# Altium project Projet_Carte_Bras_TurtleBot.PrjPcb
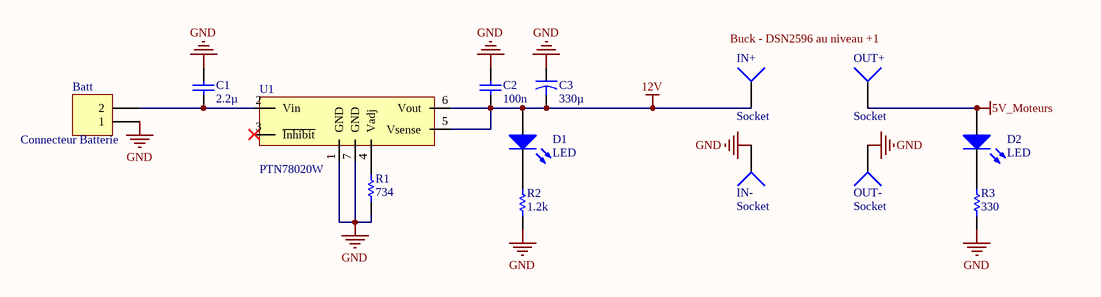
[diagram p0: Alimentations.SchDoc]
4 sheets, 89 parts. Net scope: flat (ports and power ports of the same name join across sheets).
Board file: PCB1.PcbDoc
Sheets:
  Alimentations.SchDoc
  Microcontroleur.SchDoc
  Connecteurs.SchDoc
  Controle Moteurs.SchDoc

## Sheet Alimentations.SchDoc
size A4

### Parts
Batt  Connecteur Batterie  [SHDR2W95P0X381_1X2_901X700X940P]
C1  value 2.2µ  [0805]  (hidden comment: Cap)
C2  value 100n  [0805]  (hidden comment: Cap)
C3  value 330µ  [CAPR5-4X5]  (hidden comment: Cap2)
D1  LED  [C0805]
D2  LED  [C0805]
IN+  Socket  [PIN1]
IN-  Socket  [PIN1]
OUT+  Socket  [PIN1]
OUT-  Socket  [PIN1]
R1  value 734  [0805]  (hidden comment: Res*)
R2  value 1.2k  [0805]  (hidden comment: Res*)
R3  value 330  [0805]  (hidden comment: Res*)
U1  PTN78020W  [PTN78020WAH]

### Nets
5V_Moteurs: D2.1(A) OUT+.1
12V: C2.1 C3.2 D1.1(A) IN+.1 U1.5(Vsense) U1.6(Vout)
GND: Batt.1 C1.2 C2.2 C3.1 IN-.1 OUT-.1 R1.1 R2.1 R3.2 U1.1(GND) U1.7(GND)
NetBatt_2: Batt.2 C1.1 U1.2(Vin)
NetD1_2: D1.2(K) R2.2
NetD2_2: D2.2(K) R3.1
NetR1_2: R1.2 U1.4(Vadj)

Not connected (* = marked no-connect by the designer): U1 3(~{Inhibit})*

### Notes on the sheet
- Labels drawn without touching a wire or pin: Buck - DSN2596 au niveau +1

### Library data of the parts
Batt = Header 2: Header, 2-Pin; LatestRevisionDate: 17-Jul-2002; LatestRevisionNote: Re-released for DXP Platform.; Publisher: Altium Limited
C1 = Cap: 2.2µ; Published: 8-Jun-2000; LatestRevisionDate: 17-Jul-2002; LatestRevisionNote: Re-released for DXP Platform.; PackageReference: RAD-0.3; Publisher: Altium Limited
C2 = Cap: 100n; Published: 8-Jun-2000; LatestRevisionDate: 17-Jul-2002; LatestRevisionNote: Re-released for DXP Platform.; PackageReference: RAD-0.3; Publisher: Altium Limited
C3 = Cap2: 330µ; Published: 23-Sep-2002; PackageReference: CAPR5-4X5; Publisher: Altium Limited
D1 = LED1: LED Bleu; Published: 8-Jun-2000; LatestRevisionDate: 08-Jul-2005; LatestRevisionNote: Mech Layer 1 removed.; PackageReference: LED-1; Publisher: Altium Limited
D2 = LED1: LED Verte; Published: 8-Jun-2000; LatestRevisionDate: 08-Jul-2005; LatestRevisionNote: Mech Layer 1 removed.; PackageReference: LED-1; Publisher: Altium Limited
R1 = Res1: 734R 1%; Published: 8-Jun-2000; LatestRevisionDate: 17-Jul-2002; LatestRevisionNote: Re-released for DXP Platform.; PackageReference: AXIAL-0.3; Publisher: Altium Limited
R2 = Res1: 1.2k; Published: 8-Jun-2000; LatestRevisionDate: 17-Jul-2002; LatestRevisionNote: Re-released for DXP Platform.; PackageReference: AXIAL-0.3; Publisher: Altium Limited
R3 = Res1: 330R; Published: 8-Jun-2000; LatestRevisionDate: 17-Jul-2002; LatestRevisionNote: Re-released for DXP Platform.; PackageReference: AXIAL-0.3; Publisher: Altium Limited
U1 = PTN78020W: Alim à découpage 6A
IN+ IN- OUT+ OUT- = Socket: LatestRevisionDate: 17-Jul-2002; LatestRevisionNote: Re-released for DXP Platform.; Publisher: Altium Limited

## Sheet Microcontroleur.SchDoc
size A4
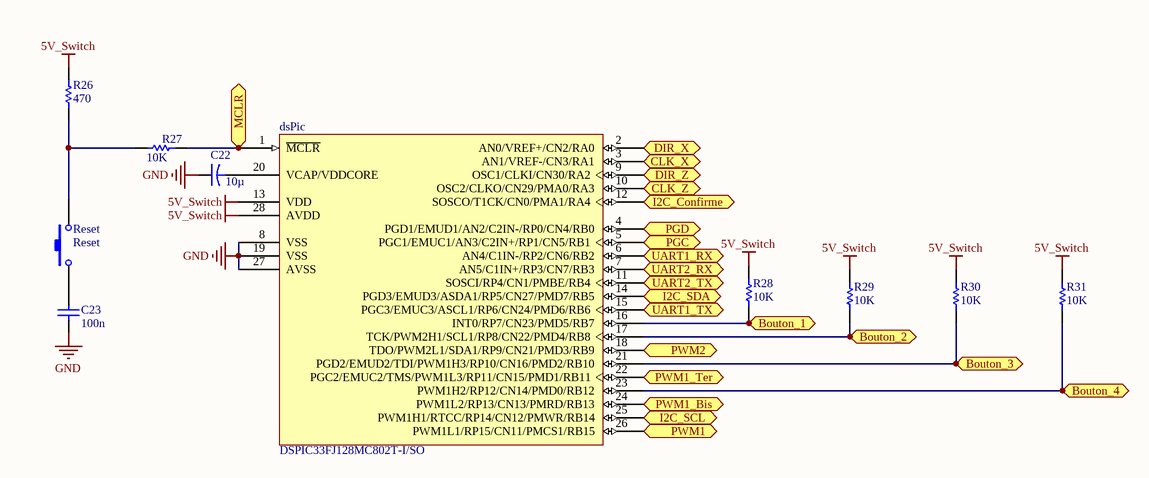
[diagram p1: Microcontroleur.SchDoc]

### Parts
C22  value 10µ  [CAPR5-4X5]  (hidden comment: Cap2)
C23  value 100n  [0805]  (hidden comment: Cap)
dsPic  DSPIC33FJ128MC802T-I/SO  [SOIC-SO28_N]
R26  value 470  [0805]  (hidden comment: Res1)
R27  value 10K  [0805]  (hidden comment: Res1)
R28  value 10K  [0805]  (hidden comment: Res1)
R29  value 10K  [0805]  (hidden comment: Res1)
R30  value 10K  [0805]  (hidden comment: Res1)
R31  value 10K  [0805]  (hidden comment: Res1)
Reset  Reset  [SPST-2]

### Ports
Bouton_1, Bouton_2, Bouton_3, Bouton_4, CLK_X, CLK_Z, DIR_X, DIR_Z, I2C_Confirme, I2C_SCL, I2C_SDA, MCLR, PGC, PGD, PWM1, PWM1_Bis, PWM1_Ter, PWM2, UART1_RX, UART1_TX, UART2_RX, UART2_TX

### Nets
5V_Switch: dsPic.13(VDD) dsPic.28(AVDD) R26.2 R28.1 R29.1 R30.1 R31.1
GND: C22.1 C23.2 dsPic.8(VSS) dsPic.19(VSS) dsPic.27(AVSS)
NetBT1_2: dsPic.16(INT0/RP7/CN23/PMD5/RB7) R28.2 ; port Bouton_1
NetBT2_2: dsPic.17(TCK/PWM2H1/SCL1/RP8/CN22/PMD4/RB8) R29.2 ; port Bouton_2
NetBT3_2: dsPic.21(PGD2/EMUD2/TDI/PWM1H3/RP10/CN16/PMD2/RB10) R30.2 ; port Bouton_3
NetBT4_2: dsPic.23(PWM1H2/RP12/CN14/PMD0/RB12) R31.2 ; port Bouton_4
NetC22_2: C22.2 dsPic.20(VCAP/VDDCORE)
NetC23_1: C23.1 Reset.1
NetdsPic_1: dsPic.1(~{MCLR}) R27.2 ; port MCLR
NetdsPic_2: dsPic.2(AN0/VREF+/CN2/RA0) ; port DIR_X
NetdsPic_3: dsPic.3(AN1/VREF-/CN3/RA1) ; port CLK_X
NetdsPic_4: dsPic.4(PGD1/EMUD1/AN2/C2IN-/RP0/CN4/RB0) ; port PGD
NetdsPic_5: dsPic.5(PGC1/EMUC1/AN3/C2IN+/RP1/CN5/RB1) ; port PGC
NetdsPic_6: dsPic.6(AN4/C1IN-/RP2/CN6/RB2) ; port UART1_RX
NetdsPic_7: dsPic.7(AN5/C1IN+/RP3/CN7/RB3) ; port UART2_RX
NetdsPic_9: dsPic.9(OSC1/CLKI/CN30/RA2) ; port DIR_Z
NetdsPic_10: dsPic.10(OSC2/CLKO/CN29/PMA0/RA3) ; port CLK_Z
NetdsPic_11: dsPic.11(SOSCI/RP4/CN1/PMBE/RB4) ; port UART2_TX
NetdsPic_12: dsPic.12(SOSCO/T1CK/CN0/PMA1/RA4) ; port I2C_Confirme
NetdsPic_14: dsPic.14(PGD3/EMUD3/ASDA1/RP5/CN27/PMD7/RB5) ; port I2C_SDA
NetdsPic_15: dsPic.15(PGC3/EMUC3/ASCL1/RP6/CN24/PMD6/RB6) ; port UART1_TX
NetdsPic_18: dsPic.18(TDO/PWM2L1/SDA1/RP9/CN21/PMD3/RB9) ; port PWM2
NetdsPic_22: dsPic.22(PGC2/EMUC2/TMS/PWM1L3/RP11/CN15/PMD1/RB11) ; port PWM1_Ter
NetdsPic_24: dsPic.24(PWM1L2/RP13/CN13/PMRD/RB13) ; port PWM1_Bis
NetdsPic_25: dsPic.25(PWM1H1/RTCC/RP14/CN12/PMWR/RB14) ; port I2C_SCL
NetdsPic_26: dsPic.26(PWM1L1/RP15/CN11/PMCS1/RB15) ; port PWM1
NetR26_1: R26.1 R27.1 Reset.2

### Library data of the parts
C22 = Cap2: 10µ; Published: 23-Sep-2002; PackageReference: CAPR5-4X5; Publisher: Altium Limited
C23 = Cap: 100n; Published: 8-Jun-2000; LatestRevisionDate: 17-Jul-2002; LatestRevisionNote: Re-released for DXP Platform.; PackageReference: RAD-0.3; Publisher: Altium Limited
dsPic = DSPIC33FJ128MC802T-I/SO: High-Performance 16-bit Digital Signal Controller, 128 KB Flash, 16 KB RAM, 28-Pin SOIC, Industrial Temperature, Tape and Reel; FirstPublished: 29-Jan-2009; LatestRevisionDate: 02-Dec-2009; LatestRevisionNote: Updated to datasheet revision D, Nov-2009; DatasheetVersion: revD, Nov-2009; PackageVersion: revBB, Aug-2009; PackageReference: SOIC-SO28; Publisher: Altium Limited; PackageDescription: 28-Lead Plastic Small Outline (SO) - Wide 7.50mm Body [SOIC]; Supplier 1: Digi-Key; Supplier Part Number 1: DSPIC33FJ128MC802T-I/SOTR-ND; Supplier 2: Newark; Supplier Part Number 2: 39M8142; Code_JEDEC: MS-013; ComponentLink1Description: Datasheet; ComponentLink1URL: http://ww1.microchip.com/downloads/en/DeviceDoc/70291D.pdf; ComponentLink2Description: Packaging Specification; ComponentLink2URL: http://www.microchip.com/stellent/groups/techpub_sg/documents/packagingspec/en012702.pdf; ComponentLink3Description: Microchip.com Home; ComponentLink3URL: http://www.microchip.com/
R26 = Res1: 470R; Published: 8-Jun-2000; LatestRevisionDate: 17-Jul-2002; LatestRevisionNote: Re-released for DXP Platform.; PackageReference: AXIAL-0.3; Publisher: Altium Limited
R27-R31 = Res1: 10k; Published: 8-Jun-2000; LatestRevisionDate: 17-Jul-2002; LatestRevisionNote: Re-released for DXP Platform.; PackageReference: AXIAL-0.3; Publisher: Altium Limited
Reset = SW-PB: Bouton Reset; Published: 24-Mar-1999; LatestRevisionDate: 17-Jul-2002; LatestRevisionNote: Re-released for DXP Platform.; PackageReference: SPST-2; Publisher: Altium Limited; PackageDescription: Switch; 2 Leads

## Sheet Connecteurs.SchDoc
size A4
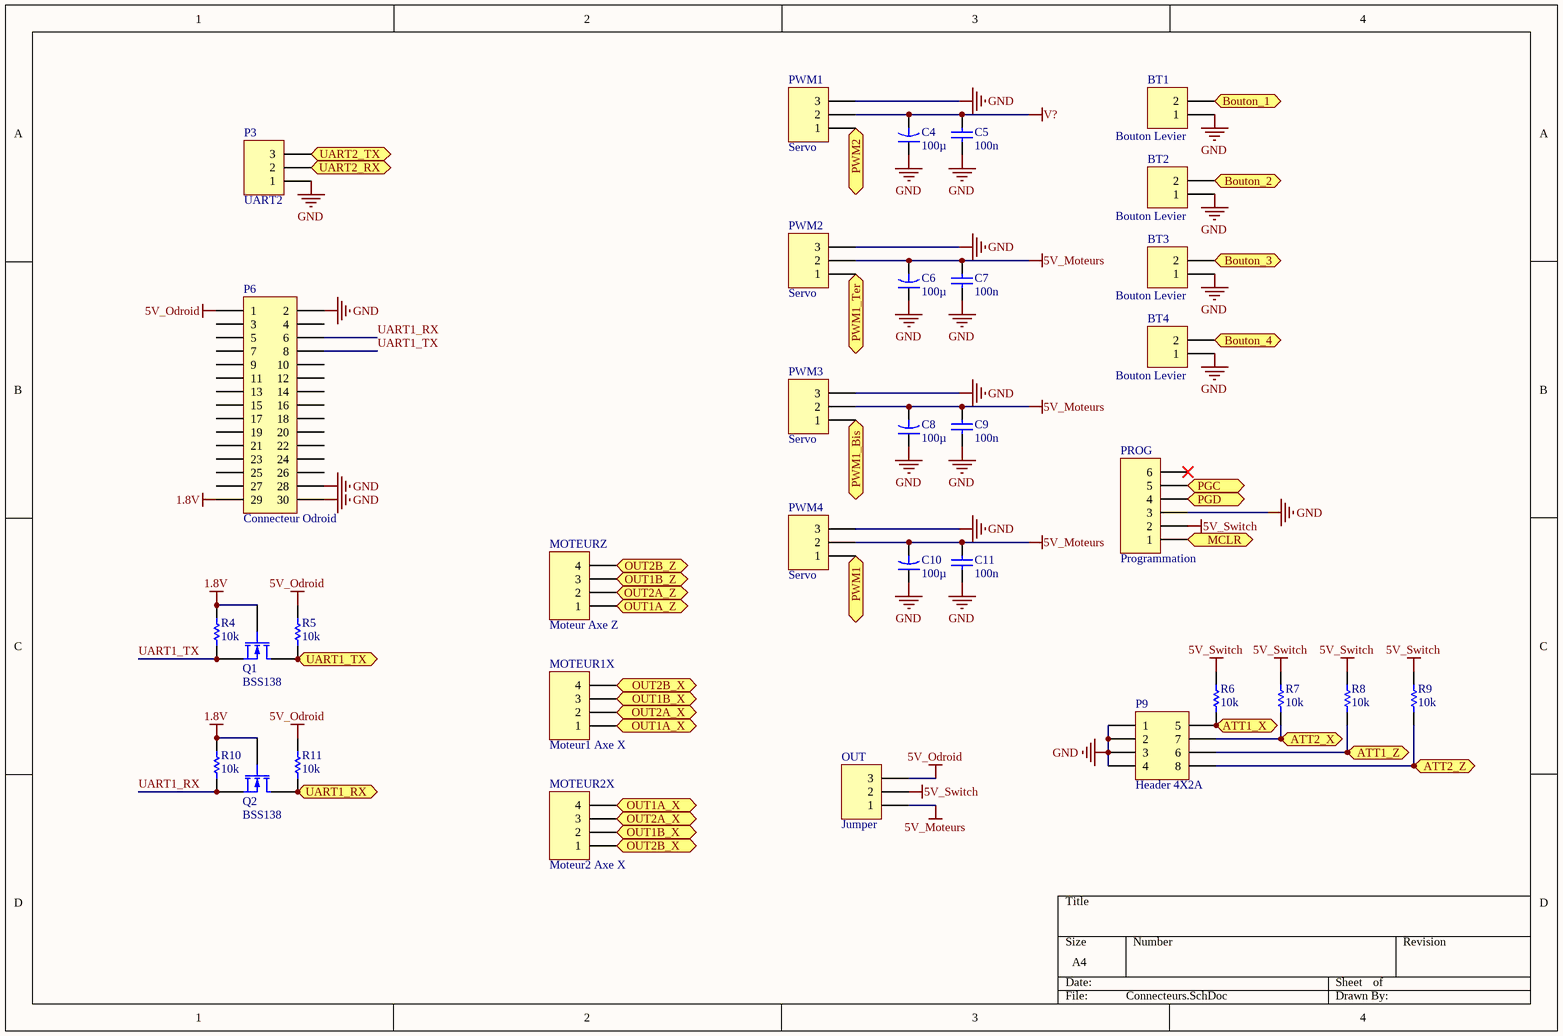
[diagram p2: Connecteurs.SchDoc]

### Parts
BT1  Bouton Levier  [HDR1X2]
BT2  Bouton Levier  [HDR1X2]
BT3  Bouton Levier  [HDR1X2]
BT4  Bouton Levier  [HDR1X2]
C4  value 100µ  [CAPR5-4X5]  (hidden comment: Cap2)
C5  value 100n  [0805]  (hidden comment: Cap)
C6  value 100µ  [CAPR5-4X5]  (hidden comment: Cap2)
C7  value 100n  [0805]  (hidden comment: Cap)
C8  value 100µ  [CAPR5-4X5]  (hidden comment: Cap2)
C9  value 100n  [0805]  (hidden comment: Cap)
C10  value 100µ  [CAPR5-4X5]  (hidden comment: Cap2)
C11  value 100n  [0805]  (hidden comment: Cap)
MOTEUR1X  Moteur1 Axe X  [HDR1X4]
MOTEUR2X  Moteur2 Axe X  [HDR1X4]
MOTEURZ  Moteur Axe Z  [HDR1X4]
OUT  Jumper  [HDR1X3]
P3  UART2  [HDR1X3]
P6  Connecteur Odroid  [HDR2X15]
P9  Header 4X2A  [Interrupteur coulissant]
PROG  Programmation  [690367280676]
PWM1  Servo  [HDR1X3]
PWM2  Servo  [HDR1X3]
PWM3  Servo  [HDR1X3]
PWM4  Servo  [HDR1X3]
Q1  BSS138  [SOT23-3_N]
Q2  BSS138  [SOT23-3_N]
R4  value 10k  [0805]  (hidden comment: Res*)
R5  value 10k  [0805]  (hidden comment: Res*)
R6  value 10k  [0805]  (hidden comment: Res*)
R7  value 10k  [0805]  (hidden comment: Res*)
R8  value 10k  [0805]  (hidden comment: Res*)
R9  value 10k  [0805]  (hidden comment: Res*)
R10  value 10k  [0805]  (hidden comment: Res*)
R11  value 10k  [0805]  (hidden comment: Res*)

### Ports
ATT1_X, ATT1_Z, ATT2_X, ATT2_Z, Bouton_1, Bouton_2, Bouton_3, Bouton_4, MCLR, OUT1A_X, OUT1A_Z, OUT1B_X, OUT1B_Z, OUT2A_X, OUT2A_Z, OUT2B_X, OUT2B_Z, PGC, PGD, PWM1, PWM1_Bis, PWM1_Ter, PWM2, UART1_RX, UART1_TX, UART2_RX, UART2_TX

### Nets
1.8V: P6.29 Q1.2(G) Q2.2(G) R4.1 R10.1
5V_Moteurs: C6.2 C7.1 C8.2 C9.1 C10.2 C11.1 OUT.1 PWM2.2 PWM3.2 PWM4.2
5V_Odroid: OUT.3 P6.1 R5.1 R11.1
5V_Switch: OUT.2 PROG.2 R6.1 R7.1 R8.1 R9.1
GND: BT1.1 BT2.1 BT3.1 BT4.1 C4.1 C5.2 C6.1 C7.2 C8.1 C9.2 C10.1 C11.2 P3.1 P6.2 P6.28 P6.30 P9.1 P9.2 P9.3 P9.4 PROG.3 PWM1.3 PWM2.3 PWM3.3 PWM4.3
V?: C4.2 C5.1 PWM1.2
UART1_RX: P6.6 Q2.3(S) R10.2
UART1_TX: P6.8 Q1.3(S) R4.2
NetBT1_2: BT1.2 ; port Bouton_1
NetBT2_2: BT2.2 ; port Bouton_2
NetBT3_2: BT3.2 ; port Bouton_3
NetBT4_2: BT4.2 ; port Bouton_4
NetdsPic_1: PROG.1 ; port MCLR
NetdsPic_4: PROG.4 ; port PGD
NetdsPic_5: PROG.5 ; port PGC
NetdsPic_6: Q2.1(D) R11.2 ; port UART1_RX
NetdsPic_7: P3.2 ; port UART2_RX
NetdsPic_11: P3.3 ; port UART2_TX
NetdsPic_15: Q1.1(D) R5.2 ; port UART1_TX
NetdsPic_18: PWM1.1 ; port PWM2
NetdsPic_22: PWM2.1 ; port PWM1_Ter
NetdsPic_24: PWM3.1 ; port PWM1_Bis
NetdsPic_26: PWM4.1 ; port PWM1
NetJ5_3: MOTEURZ.1 ; port OUT1A_Z
NetJ5_7: MOTEURZ.3 ; port OUT1B_Z
NetJ5_8: MOTEURZ.2 ; port OUT2A_Z
NetJ5_12: MOTEURZ.4 ; port OUT2B_Z
NetJ5_24: P9.6 R8.2 ; port ATT1_Z
NetJ5_25: P9.8 R9.2 ; port ATT2_Z
NetJ6_3: MOTEUR1X.1 MOTEUR2X.4 ; port OUT1A_X
NetJ6_7: MOTEUR1X.3 MOTEUR2X.2 ; port OUT1B_X
NetJ6_8: MOTEUR1X.2 MOTEUR2X.3 ; port OUT2A_X
NetJ6_12: MOTEUR1X.4 MOTEUR2X.1 ; port OUT2B_X
NetJ6_24: P9.5 R6.2 ; port ATT1_X
NetJ6_25: P9.7 R7.2 ; port ATT2_X

Not connected (* = marked no-connect by the designer): P6 3 4 5 7 9 10 11 12 13 14 15 16 17 18 19 20 21 22 23 24 25 26 27; PROG 6*

### Library data of the parts
BT1-BT4 = Header 2: Header, 2-Pin; LatestRevisionDate: 17-Jul-2002; LatestRevisionNote: Re-released for DXP Platform.; Publisher: Altium Limited
C4 C6 C8 C10 = Cap2: 100µ; Published: 23-Sep-2002; PackageReference: CAPR5-4X5; Publisher: Altium Limited
C5 C7 C9 C11 = Cap: 100n; Published: 8-Jun-2000; LatestRevisionDate: 17-Jul-2002; LatestRevisionNote: Re-released for DXP Platform.; PackageReference: RAD-0.3; Publisher: Altium Limited
MOTEUR1X MOTEUR2X MOTEURZ = Header 4: Header, 4-Pin; LatestRevisionDate: 17-Jul-2002; LatestRevisionNote: Re-released for DXP Platform.; Publisher: Altium Limited
OUT P3 PWM1-PWM4 = Header 3: Header, 3-Pin; LatestRevisionDate: 17-Jul-2002; LatestRevisionNote: Re-released for DXP Platform.; Publisher: Altium Limited
P6 = Header 15X2: Header, 15-Pin, Dual row; LatestRevisionDate: 17-Jul-2002; LatestRevisionNote: Re-released for DXP Platform.; Publisher: Altium Limited
P9 = Header 4X2A: Header, 4-Pin, Dual row; LatestRevisionDate: 17-Jul-2002; LatestRevisionNote: Re-released for DXP Platform.; Publisher: Altium Limited
PROG = Header 6: Header, 6-Pin; LatestRevisionDate: 17-Jul-2002; LatestRevisionNote: Re-released for DXP Platform.; Publisher: Altium Limited
Q1 Q2 = MOSFET-N: N-Channel MOSFET; Published: 8-Jun-2000; LatestRevisionDate: 17-Jul-2002; LatestRevisionNote: Re-released for DXP Platform.; PackageVersion: 1995/1996; PackageReference: E3; Publisher: Altium Limited; PackageDescription: TO, Flat Index; 3 In-Line, Axial Leads; Body Dia. 4.6mm; Lead Dia. 0.5 mm (max)
R4-R11 = Res1: 10k; Published: 8-Jun-2000; LatestRevisionDate: 17-Jul-2002; LatestRevisionNote: Re-released for DXP Platform.; PackageReference: AXIAL-0.3; Publisher: Altium Limited

## Sheet Controle Moteurs.SchDoc
size A4
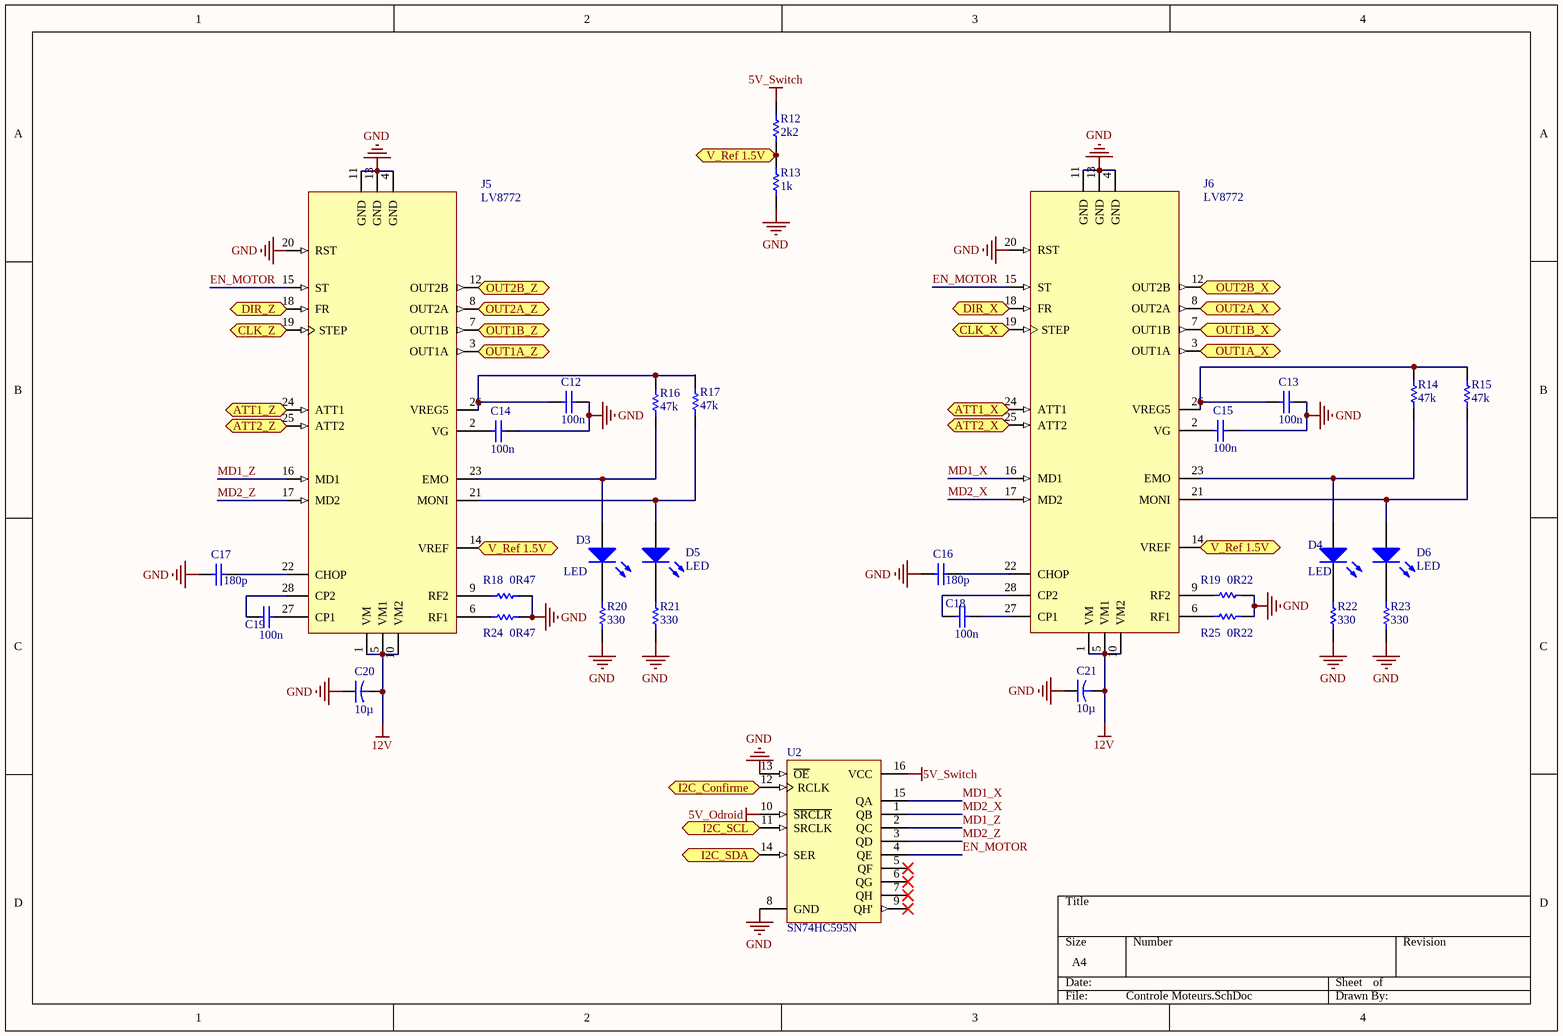
[diagram p3: Controle Moteurs.SchDoc]

### Parts
C12  value 100n  [0805]  (hidden comment: Cap)
C13  value 100n  [0805]  (hidden comment: Cap)
C14  value 100n  [0805]  (hidden comment: Cap)
C15  value 100n  [0805]  (hidden comment: Cap)
C16  value 180p  [0805]  (hidden comment: Cap)
C17  value 180p  [0805]  (hidden comment: Cap)
C18  value 100n  [0805]  (hidden comment: Cap)
C19  value 100n  [0805]  (hidden comment: Cap)
C20  value 10µ  [CAPR5-4X5]  (hidden comment: Cap2)
C21  value 10µ  [CAPR5-4X5]  (hidden comment: Cap2)
D3  LED  [C0805]
D4  LED  [C0805]
D5  LED  [C0805]
D6  LED  [C0805]
J5  LV8772  [DIP-28/P1.78]
J6  LV8772  [DIP-28/P1.78]
R12  value 2k2  [0805]  (hidden comment: Res*)
R13  value 1k  [0805]  (hidden comment: Res*)
R14  value 47k  [0805]  (hidden comment: Res*)
R15  value 47k  [0805]  (hidden comment: Res*)
R16  value 47k  [0805]  (hidden comment: Res*)
R17  value 47k  [0805]  (hidden comment: Res*)
R18  value 0R47  [0805]  (hidden comment: Res*)
R19  value 0R22  [0805]  (hidden comment: Res*)
R20  value 330  [0805]  (hidden comment: Res*)
R21  value 330  [0805]  (hidden comment: Res*)
R22  value 330  [0805]  (hidden comment: Res*)
R23  value 330  [0805]  (hidden comment: Res*)
R24  value 0R47  [0805]  (hidden comment: Res*)
R25  value 0R22  [0805]  (hidden comment: Res*)
U2  SN74HC595N  [SOIC-SO16_M]

### Ports
ATT1_X, ATT1_Z, ATT2_X, ATT2_Z, CLK_X, CLK_Z, DIR_X, DIR_Z, I2C_Confirme, I2C_SCL, I2C_SDA, OUT1A_X, OUT1A_Z, OUT1B_X, OUT1B_Z, OUT2A_X, OUT2A_Z, OUT2B_X, OUT2B_Z, V_Ref 1.5V

### Nets
5V_Odroid: U2.10(~{SRCLR})
5V_Switch: R12.1 U2.16(VCC)
12V: C20.2 C21.2 J5.1(VM) J5.5(VM1) J5.10(VM2) J6.1(VM) J6.5(VM1) J6.10(VM2)
GND: C12.2 C13.2 C14.1 C15.1 C16.2 C17.2 C20.1 C21.1 J5.4(GND) J5.11(GND) J5.13(GND) J5.20(RST) J6.4(GND) J6.11(GND) J6.13(GND) J6.20(RST) R13.2 R18.1 R19.1 R20.2 R21.2 R22.2 R23.2 R24.1 R25.1 U2.8(GND) U2.13(~{OE})
EN_MOTOR: J5.15(ST) J6.15(ST) U2.4(QE)
MD1_X: J6.16(MD1) U2.15(QA)
MD1_Z: J5.16(MD1) U2.2(QC)
MD2_X: J6.17(MD2) U2.1(QB)
MD2_Z: J5.17(MD2) U2.3(QD)
NetC12_1: C12.1 J5.26(VREG5) R16.1 R17.1
NetC13_1: C13.1 J6.26(VREG5) R14.1 R15.1
NetC14_2: C14.2 J5.2(VG)
NetC15_2: C15.2 J6.2(VG)
NetC16_1: C16.1 J6.22(CHOP)
NetC17_1: C17.1 J5.22(CHOP)
NetC18_1: C18.1 J6.27(CP1)
NetC18_2: C18.2 J6.28(CP2)
NetC19_1: C19.1 J5.27(CP1)
NetC19_2: C19.2 J5.28(CP2)
NetD3_1: D3.1(A) J5.23(EMO) R16.2
NetD3_2: D3.2(K) R20.1
NetD4_1: D4.1(A) J6.23(EMO) R14.2
NetD4_2: D4.2(K) R22.1
NetD5_1: D5.1(A) J5.21(MONI) R17.2
NetD5_2: D5.2(K) R21.1
NetD6_1: D6.1(A) J6.21(MONI) R15.2
NetD6_2: D6.2(K) R23.1
NetdsPic_2: J6.18(FR) ; port DIR_X
NetdsPic_3: J6.19(STEP) ; port CLK_X
NetdsPic_9: J5.18(FR) ; port DIR_Z
NetdsPic_10: J5.19(STEP) ; port CLK_Z
NetdsPic_12: U2.12(RCLK) ; port I2C_Confirme
NetdsPic_14: U2.14(SER) ; port I2C_SDA
NetdsPic_25: U2.11(SRCLK) ; port I2C_SCL
NetJ5_3: J5.3(OUT1A) ; port OUT1A_Z
NetJ5_6: J5.6(RF1) R24.2
NetJ5_7: J5.7(OUT1B) ; port OUT1B_Z
NetJ5_8: J5.8(OUT2A) ; port OUT2A_Z
NetJ5_9: J5.9(RF2) R18.2
NetJ5_12: J5.12(OUT2B) ; port OUT2B_Z
NetJ5_14: J5.14(VREF) J6.14(VREF) R12.2 R13.1 ; port V_Ref 1.5V
NetJ5_24: J5.24(ATT1) ; port ATT1_Z
NetJ5_25: J5.25(ATT2) ; port ATT2_Z
NetJ6_3: J6.3(OUT1A) ; port OUT1A_X
NetJ6_6: J6.6(RF1) R25.2
NetJ6_7: J6.7(OUT1B) ; port OUT1B_X
NetJ6_8: J6.8(OUT2A) ; port OUT2A_X
NetJ6_9: J6.9(RF2) R19.2
NetJ6_12: J6.12(OUT2B) ; port OUT2B_X
NetJ6_24: J6.24(ATT1) ; port ATT1_X
NetJ6_25: J6.25(ATT2) ; port ATT2_X

Not connected (* = marked no-connect by the designer): U2 5(QF)* 6(QG)* 7(QH)* 9(QH')*

### Library data of the parts
C12-C15 C18 C19 = Cap: 100n; Published: 8-Jun-2000; LatestRevisionDate: 17-Jul-2002; LatestRevisionNote: Re-released for DXP Platform.; PackageReference: RAD-0.3; Publisher: Altium Limited
C16 C17 = Cap: 180p; Published: 8-Jun-2000; LatestRevisionDate: 17-Jul-2002; LatestRevisionNote: Re-released for DXP Platform.; PackageReference: RAD-0.3; Publisher: Altium Limited
C20 C21 = Cap2: 10µ; Published: 23-Sep-2002; PackageReference: CAPR5-4X5; Publisher: Altium Limited
D3-D6 = LED1: LED Rouge; Published: 8-Jun-2000; LatestRevisionDate: 08-Jul-2005; LatestRevisionNote: Mech Layer 1 removed.; PackageReference: LED-1; Publisher: Altium Limited
J5 J6 = LV8772: Driver Pas à Pas
R12 = Res1: 2.2k; Published: 8-Jun-2000; LatestRevisionDate: 17-Jul-2002; LatestRevisionNote: Re-released for DXP Platform.; PackageReference: 0805; Publisher: Altium Limited
R13 = Res1: 1k; Published: 8-Jun-2000; LatestRevisionDate: 17-Jul-2002; LatestRevisionNote: Re-released for DXP Platform.; PackageReference: 0805; Publisher: Altium Limited
R14-R17 = Res1: 47k; Published: 8-Jun-2000; LatestRevisionDate: 17-Jul-2002; LatestRevisionNote: Re-released for DXP Platform.; Publisher: Altium Limited
  R14-R16: PackageReference: AXIAL-0.3
  R17: PackageReference: 0805
R18 R24 = Res1: 470m; Published: 8-Jun-2000; LatestRevisionDate: 17-Jul-2002; LatestRevisionNote: Re-released for DXP Platform.; PackageReference: AXIAL-0.3; Publisher: Altium Limited
R19 R25 = Res1: 220m; Published: 8-Jun-2000; LatestRevisionDate: 17-Jul-2002; LatestRevisionNote: Re-released for DXP Platform.; PackageReference: AXIAL-0.3; Publisher: Altium Limited
R20-R23 = Res1: 330R; Published: 8-Jun-2000; LatestRevisionDate: 17-Jul-2002; LatestRevisionNote: Re-released for DXP Platform.; PackageReference: AXIAL-0.3; Publisher: Altium Limited
U2 = SN74HC595N: 8-Bit Shift Register with 3-State Output Registers; Published: 8-Jun-2000; LatestRevisionDate: 04-Mar-2005; LatestRevisionNote: Stylized 3D Model Added.; DatasheetVersion: May-1997; PackageVersion: Oct-1995; PackageReference: N016; Publisher: Altium Limited; PackageDescription: DIP; 16 Leads; Row Spacing 7.62 mm; Pitch 2.54 mm; Code_JEDEC: MS-001-BB; ComponentLink1Description: Manufacturer Link; ComponentLink1URL: http://www.ti.com/; ComponentLink2Description: Datasheet; ComponentLink2URL: http://www-s.ti.com/sc/ds/sn74hc595.pdf

## Nets that join several sheets
5V_Moteurs: Alimentations (D2.1 OUT+.1), Connecteurs (10 pins)
5V_Odroid: Connecteurs (OUT.3 P6.1 R5.1 R11.1), Controle Moteurs (U2.10)
5V_Switch: Microcontroleur (7 pins), Connecteurs (6 pins), Controle Moteurs (R12.1 U2.16)
12V: Alimentations (6 pins), Controle Moteurs (8 pins)
GND: Alimentations (11 pins), Microcontroleur (5 pins), Connecteurs (25 pins), Controle Moteurs (27 pins)
NetBT1_2: Microcontroleur (dsPic.16 R28.2), Connecteurs (BT1.2)
NetBT2_2: Microcontroleur (dsPic.17 R29.2), Connecteurs (BT2.2)
NetBT3_2: Microcontroleur (dsPic.21 R30.2), Connecteurs (BT3.2)
NetBT4_2: Microcontroleur (dsPic.23 R31.2), Connecteurs (BT4.2)
NetdsPic_1: Microcontroleur (dsPic.1 R27.2), Connecteurs (PROG.1)
NetdsPic_2: Microcontroleur (dsPic.2), Controle Moteurs (J6.18)
NetdsPic_3: Microcontroleur (dsPic.3), Controle Moteurs (J6.19)
NetdsPic_4: Microcontroleur (dsPic.4), Connecteurs (PROG.4)
NetdsPic_5: Microcontroleur (dsPic.5), Connecteurs (PROG.5)
NetdsPic_6: Microcontroleur (dsPic.6), Connecteurs (Q2.1 R11.2)
NetdsPic_7: Microcontroleur (dsPic.7), Connecteurs (P3.2)
NetdsPic_9: Microcontroleur (dsPic.9), Controle Moteurs (J5.18)
NetdsPic_10: Microcontroleur (dsPic.10), Controle Moteurs (J5.19)
NetdsPic_11: Microcontroleur (dsPic.11), Connecteurs (P3.3)
NetdsPic_12: Microcontroleur (dsPic.12), Controle Moteurs (U2.12)
NetdsPic_14: Microcontroleur (dsPic.14), Controle Moteurs (U2.14)
NetdsPic_15: Microcontroleur (dsPic.15), Connecteurs (Q1.1 R5.2)
NetdsPic_18: Microcontroleur (dsPic.18), Connecteurs (PWM1.1)
NetdsPic_22: Microcontroleur (dsPic.22), Connecteurs (PWM2.1)
NetdsPic_24: Microcontroleur (dsPic.24), Connecteurs (PWM3.1)
NetdsPic_25: Microcontroleur (dsPic.25), Controle Moteurs (U2.11)
NetdsPic_26: Microcontroleur (dsPic.26), Connecteurs (PWM4.1)
NetJ5_3: Connecteurs (MOTEURZ.1), Controle Moteurs (J5.3)
NetJ5_7: Connecteurs (MOTEURZ.3), Controle Moteurs (J5.7)
NetJ5_8: Connecteurs (MOTEURZ.2), Controle Moteurs (J5.8)
NetJ5_12: Connecteurs (MOTEURZ.4), Controle Moteurs (J5.12)
NetJ5_24: Connecteurs (P9.6 R8.2), Controle Moteurs (J5.24)
NetJ5_25: Connecteurs (P9.8 R9.2), Controle Moteurs (J5.25)
NetJ6_3: Connecteurs (MOTEUR1X.1 MOTEUR2X.4), Controle Moteurs (J6.3)
NetJ6_7: Connecteurs (MOTEUR1X.3 MOTEUR2X.2), Controle Moteurs (J6.7)
NetJ6_8: Connecteurs (MOTEUR1X.2 MOTEUR2X.3), Controle Moteurs (J6.8)
NetJ6_12: Connecteurs (MOTEUR1X.4 MOTEUR2X.1), Controle Moteurs (J6.12)
NetJ6_24: Connecteurs (P9.5 R6.2), Controle Moteurs (J6.24)
NetJ6_25: Connecteurs (P9.7 R7.2), Controle Moteurs (J6.25)